# Altium schematic sheet AZ1117IH_3V3FixedReg.SchDoc: AZ1117IH 3.3V Linear Voltage Regulator
size A; DrawnBy: LSG; SheetNumber: 3; SheetTotal: 3
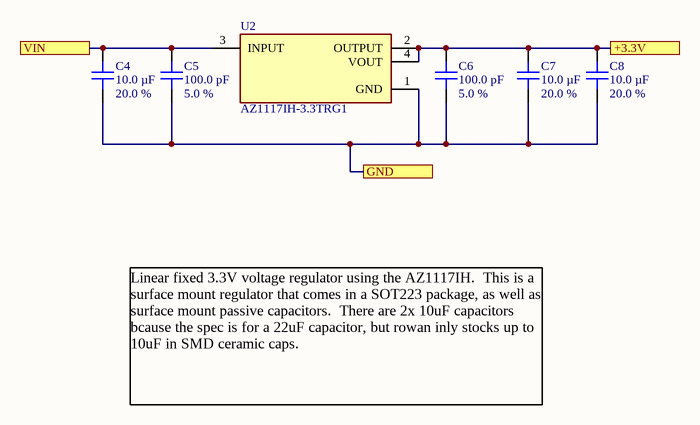
[diagram p0: AZ1117IH_3V3FixedReg.SchDoc]

## Parts
C4  10.0 µF  Tolerance: 20.0 %  [PCB - CAPACITOR - MLCC - CAP 0603_1608]
C5  100.0 pF  Tolerance: 5.0 %  [PCB - CAPACITOR - MLCC - CAP 0603_1608]
C6  100.0 pF  Tolerance: 5.0 %  [PCB - CAPACITOR - MLCC - CAP 0603_1608]
C7  10.0 µF  Tolerance: 20.0 %  [PCB - CAPACITOR - MLCC - CAP 0603_1608]
C8  10.0 µF  Tolerance: 20.0 %  [PCB - CAPACITOR - MLCC - CAP 0603_1608]
U2  AZ1117IH-3.3TRG1  [FP-SOT223-MFG]

## Ports
+3.3V, GND, VIN

## Nets
+3.3V: C6.2 C7.2 C8.2 U2.2(OUTPUT) U2.4(VOUT) ; port +3.3V
GND: C4.1 C5.1 C6.1 C7.1 C8.1 U2.1(GND) ; port GND
VIN: C4.2 C5.2 U2.3(INPUT) ; port VIN

## Notes on the sheet
- Linear fixed 3.3V voltage regulator using the AZ1117IH.  This is a surface mount regulator that comes in a SOT223 package, as well as surface mount passive capacitors.  There are 2x 10uF capacitors bcause the spec is for a 22uF capacitor, but rowan inly stocks up to 10uF in SMD ceramic caps.

## Library data of the parts
C4 C7 C8 = 1572: 10 µF ±20% 16V Ceramic Capacitor X5R 0603 (1608 Metric); Rowan Part Number: 1572; Manufacturer: YAGEO; Manufacturer part number: CC0603MRX5R7BB106; Name: 10.0 µF 16.0 V 20.0 % Ceramic Capacitor; Voltage Rating: 16.0 V; Supplier 1: Digi-Key; Supplier Part Number 1: 311-1822-2-ND; Category: Capacitors; Datasheet: https://www.yageo.com/upload/media/product/productsearch/datasheet/mlcc/UPY-GPHC_X5R_4V-to-50V_26.pdf; Status: Active; Package: 0603 (1608 Metric); Packaging: Tape & Reel (TR); Composition: Ceramic; Capacitance: 10.0 µF
C5 C6 = 1535: 100 pF ±5% 50V Ceramic Capacitor X7R 0603 (1608 Metric); Rowan Part Number: 1535; Manufacturer: YAGEO; Manufacturer part number: CC0603JRX7R9BB101; Name: 100.0 pF 50.0 V 5.0 % Ceramic Capacitor; Voltage Rating: 50.0 V; Supplier 1: Digi-Key; Supplier Part Number 1: 311-4003-2-ND; Category: Capacitors; Datasheet: https://www.yageo.com/upload/media/product/productsearch/datasheet/mlcc/UPY-GPHC_X7R_6.3V-to-50V_20.pdf; Status: Active; Package: 0603 (1608 Metric); Packaging: Tape & Reel (TR); Composition: Ceramic; Capacitance: 100.0 pF
U2 = CMP-12756-000043-1: IC REG LINEAR 3.3V 1A SOT223; Output Current: 800mA; Number of Regulators: 1; Dropout Voltage: 1.2V; RoHS Compliant: Yes; Min Current Limit: 1A; Mount: Surface Mount; Packaging: Tape and Reel; Output Voltage: 3.3V; Min Operating Temperature: -40°C; Max Operating Temperature: 125°C; Number of Pins: 3; Case/Package: TO-261-4